# Altium schematic sheet QCopterMV_POWER_Sch.SchDoc
size A4
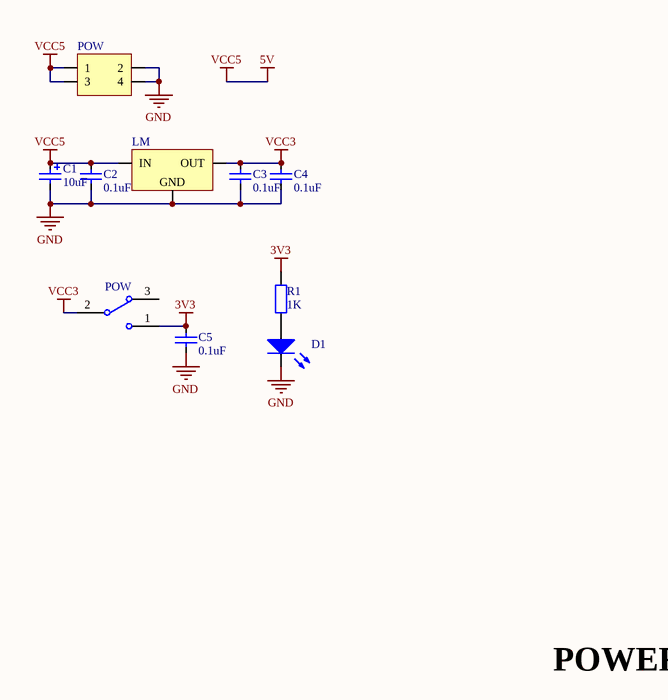
[diagram p0: QCopterMV_POWER_Sch.SchDoc]

## Parts
(Parts that share a designator on the sheet are numbered #1, #2 ... from top to bottom, then left to right.)
C1  value 10uF  [CAP_TAN_B1210]  (hidden comment: Cap_Tan_1210)
C2  value 0.1uF  [CAP_0603]  (hidden comment: Cap_0603)
C3  value 0.1uF  [CAP_0603]  (hidden comment: Cap_0603)
C4  value 0.1uF  [CAP_0603]  (hidden comment: Cap_0603)
C5  value 0.1uF  [CAP_0603]  (hidden comment: Cap_0603)
D1  LED_0603_BLUE  [LED_0603_BLUE]  (value not drawn)
LM  LM1117  [SOT223]  (value not drawn)
POW#1  HDR2X2_90_2.54  [HDR2X2_90_2.54]  (value not drawn)
POW#2  SW-SPDT  [SW_T]  (value not drawn)
R1  value 1K  [RES_0603]  (hidden comment: Res_0603)

## Nets
3V3: C5.2 POW#2.1 R1.2
5V: C1.1 C2.2 LM.3(IN) POW#1.1 POW#1.3  [also labelled VCC5]
GND: C1.2 C2.1 C3.1 C4.1 C5.1 D1.2(K) LM.1(GND) POW#1.2 POW#1.4
VCC3: C3.2 C4.2 LM.2(OUT) POW#2.2
NetD1_1: D1.1(A) R1.1

Not connected (* = marked no-connect by the designer): POW#2 3

## Notes on the sheet
- POWER

## Library data of the parts
C1 = Cap_Tan_1210: Capacitor
C2-C5 = Cap_0603: Capacitor
D1 = LED_0603_BLUE: LED
LM = LM1117: Power
POW#1 = HDR2X2_90_2.54: Header
POW#2 = SW-SPDT_1: SPDT Subminiature Toggle Switch, Right Angle Mounting, Vertical Actuation; Published: 24-Mar-1999; LatestRevisionDate: 17-Dec-2003; LatestRevisionNote: Schematic revised, PCB Footprint replaced.; DatasheetVersion: 05-Dec-2000; PackageReference: TL36WW15050; Publisher: Altium Limited; PackageDescription: Switch; 4 Leads; ComponentLink1Description: Manufacturer Link; ComponentLink1URL: http://www.apem.com
R1 = Res_0603: Resistor